# Altium schematic sheet 07-VIDEO_PORT.SchDoc
size A4
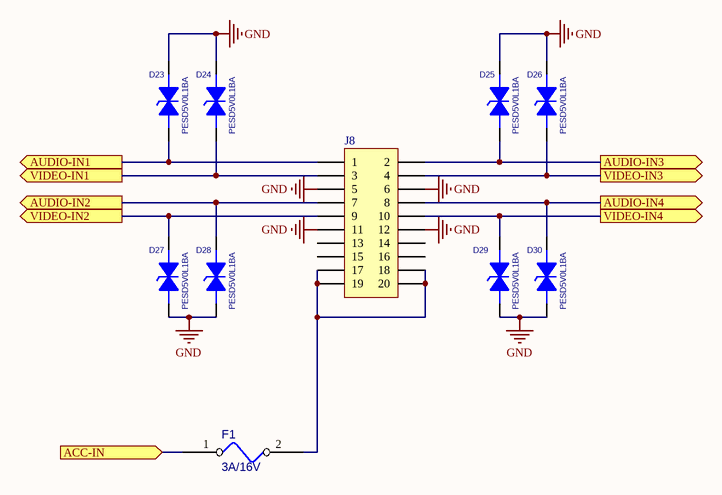
[diagram p0: 07-VIDEO_PORT.SchDoc]

## Parts
D23  PESD5V0L1BA  [PESD]
D24  PESD5V0L1BA  [PESD]
D25  PESD5V0L1BA  [PESD]
D26  PESD5V0L1BA  [PESD]
D27  PESD5V0L1BA  [PESD]
D28  PESD5V0L1BA  [PESD]
D29  PESD5V0L1BA  [PESD]
D30  PESD5V0L1BA  [PESD]
F1  3A/16V  [2920]
J8  Header 10X2  [CONN2X10]  (value not drawn)

## Ports
ACC-IN (in), AUDIO-IN1 (out), AUDIO-IN2 (out), AUDIO-IN3 (out), AUDIO-IN4 (out), VIDEO-IN1 (out), VIDEO-IN2 (out), VIDEO-IN3 (out), VIDEO-IN4 (out)

## Nets
GND: D23.2 D24.2 D25.2 D26.2 D27.1 D28.1 D29.1 D30.1 J8.5 J8.6 J8.11 J8.12
ACC-IN: F1.1 ; port ACC-IN
AUDIO-IN1: D23.1 J8.1 ; port AUDIO-IN1
AUDIO-IN2: D28.2 J8.7 ; port AUDIO-IN2
AUDIO-IN3: D25.1 J8.2 ; port AUDIO-IN3
AUDIO-IN4: D30.2 J8.8 ; port AUDIO-IN4
VIDEO-IN1: D24.1 J8.3 ; port VIDEO-IN1
VIDEO-IN2: D27.2 J8.9 ; port VIDEO-IN2
VIDEO-IN3: D26.1 J8.4 ; port VIDEO-IN3
VIDEO-IN4: D29.2 J8.10 ; port VIDEO-IN4
NetF1_2: F1.2 J8.17 J8.18 J8.19 J8.20

Not connected (* = marked no-connect by the designer): J8 13 14 15 16

## Library data of the parts
D23-D30 = PESD
F1 = 2A_32VDC_0467-002
J8 = Header 10X2: Header, 10-Pin, Dual row; LatestRevisionDate: 17-Jul-2002; LatestRevisionNote: Re-released for DXP Platform.; Publisher: Altium Limited